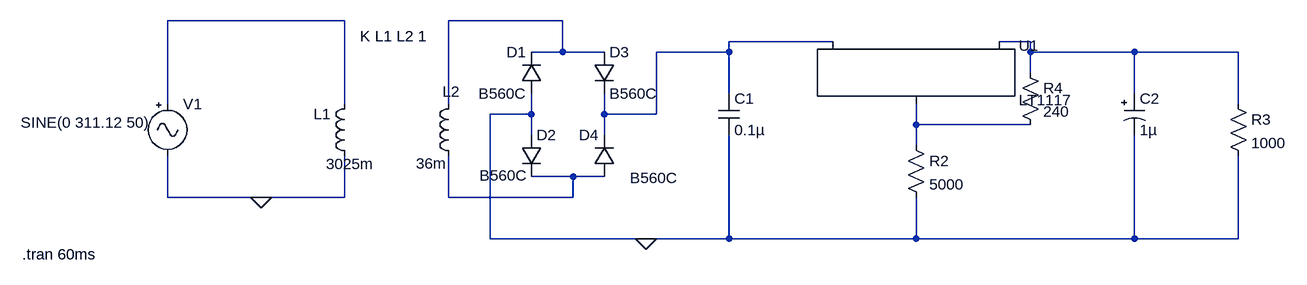
[diagram p0: schematic TASK 2 ELECT.asc]
TASK 2 ELECT.asc, the LTspice schematic file:
Version 4.1
SHEET 1 1604 680
WIRE 144 -16 -128 -16
WIRE 480 -16 304 -16
WIRE 896 16 736 16
WIRE 1200 16 1152 16
WIRE 480 32 480 -16
WIRE 480 32 432 32
WIRE 544 32 480 32
WIRE 736 32 736 16
WIRE 736 32 624 32
WIRE 1200 32 1200 16
WIRE 1360 32 1200 32
WIRE 1520 32 1360 32
WIRE 1200 64 1200 32
WIRE 736 96 736 32
WIRE 1360 96 1360 32
WIRE -128 112 -128 -16
WIRE 144 112 144 -16
WIRE 304 112 304 -16
WIRE 1520 112 1520 32
WIRE 432 128 432 96
WIRE 432 128 368 128
WIRE 544 128 544 96
WIRE 624 128 624 32
WIRE 624 128 544 128
WIRE 1024 144 1024 112
WIRE 1200 144 1024 144
WIRE 432 160 432 128
WIRE 544 160 544 128
WIRE 1024 176 1024 144
WIRE 496 224 432 224
WIRE 544 224 496 224
WIRE -128 256 -128 192
WIRE 16 256 -128 256
WIRE 144 256 144 192
WIRE 144 256 16 256
WIRE 304 256 304 192
WIRE 496 256 496 224
WIRE 496 256 304 256
WIRE 368 320 368 128
WIRE 608 320 368 320
WIRE 736 320 736 160
WIRE 736 320 608 320
WIRE 1024 320 1024 256
WIRE 1024 320 736 320
WIRE 1360 320 1360 160
WIRE 1360 320 1024 320
WIRE 1520 320 1520 192
WIRE 1520 320 1360 320
FLAG 608 320 0
FLAG 16 256 0
SYMBOL Misc\\signal -128 96 R0
WINDOW 3 -226 45 Left 2
WINDOW 123 0 0 Left 0
WINDOW 39 0 0 Left 0
SYMATTR Value SINE(0 311.12 50)
SYMATTR InstName V1
SYMBOL ind 160 208 R180
WINDOW 0 36 80 Left 2
WINDOW 3 -30 3 Left 2
SYMATTR InstName L1
SYMATTR Value 3025m
SYMATTR Type ind
SYMATTR SpiceLine Rser=0.001
SYMBOL ind 320 208 R180
WINDOW 0 -2 115 Left 2
WINDOW 3 18 4 Left 2
SYMATTR InstName L2
SYMATTR Value 36m
SYMATTR Type ind
SYMBOL diode 448 96 R180
WINDOW 0 24 64 Left 2
WINDOW 3 24 0 Left 2
SYMATTR InstName D1
SYMATTR Value B560C
SYMBOL diode 416 160 R0
WINDOW 3 -64 62 Left 2
SYMATTR Value B560C
SYMATTR InstName D2
SYMBOL diode 528 32 R0
SYMATTR InstName D3
SYMATTR Value B560C
SYMBOL diode 560 224 R180
WINDOW 0 24 64 Left 2
WINDOW 3 -97 -2 Left 2
SYMATTR InstName D4
SYMATTR Value B560C
SYMBOL cap 720 96 R0
SYMATTR InstName C1
SYMATTR Value 0.1µ
SYMBOL polcap 1344 96 R0
SYMATTR InstName C2
SYMATTR Value 1µ
SYMBOL res 1504 96 R0
SYMATTR InstName R3
SYMATTR Value 1000
SYMBOL res 1008 160 R0
SYMATTR InstName R2
SYMATTR Value 5000
SYMBOL res 1184 48 R0
SYMATTR InstName R4
SYMATTR Value 240
SYMBOL PowerProducts\\LT1117 1024 16 R0
SYMATTR InstName U1
TEXT -352 344 Left 2 !.tran 60ms
TEXT 168 8 Left 2 !K L1 L2 1

The netlist it stands for:
* TASK 2 ELECT.asc
V1 N001 0 SINE(0 311.12 50)
L1 0 N001 3025m Rser=0.001
L2 N006 N002 36m
D1 0 N002 B560C
D2 0 N006 B560C
D3 N002 N003 B560C
D4 N006 N003 B560C
C1 N003 0 0.1µ
C2 N004 0 1µ
R3 N004 0 1000
R2 N005 0 5000
R4 N004 N005 240
X§U1 N005 N004 N003 LT1117
.model D D
.lib standard.dio
.tran 60ms
K L1 L2 1
.lib LT1117.lib
.backanno
.end